# Altium schematic sheet IrIO.SchDoc: IrDA - Input/Output
size A4; Organization: Microprocessor-Design Pty Ltd; Address1: 18/110 Caroline Street; Address2: South Yarra; Address3: VIC 3141; Address4: Australia; DocumentNumber: 3; SheetNumber: 3; SheetTotal: 4
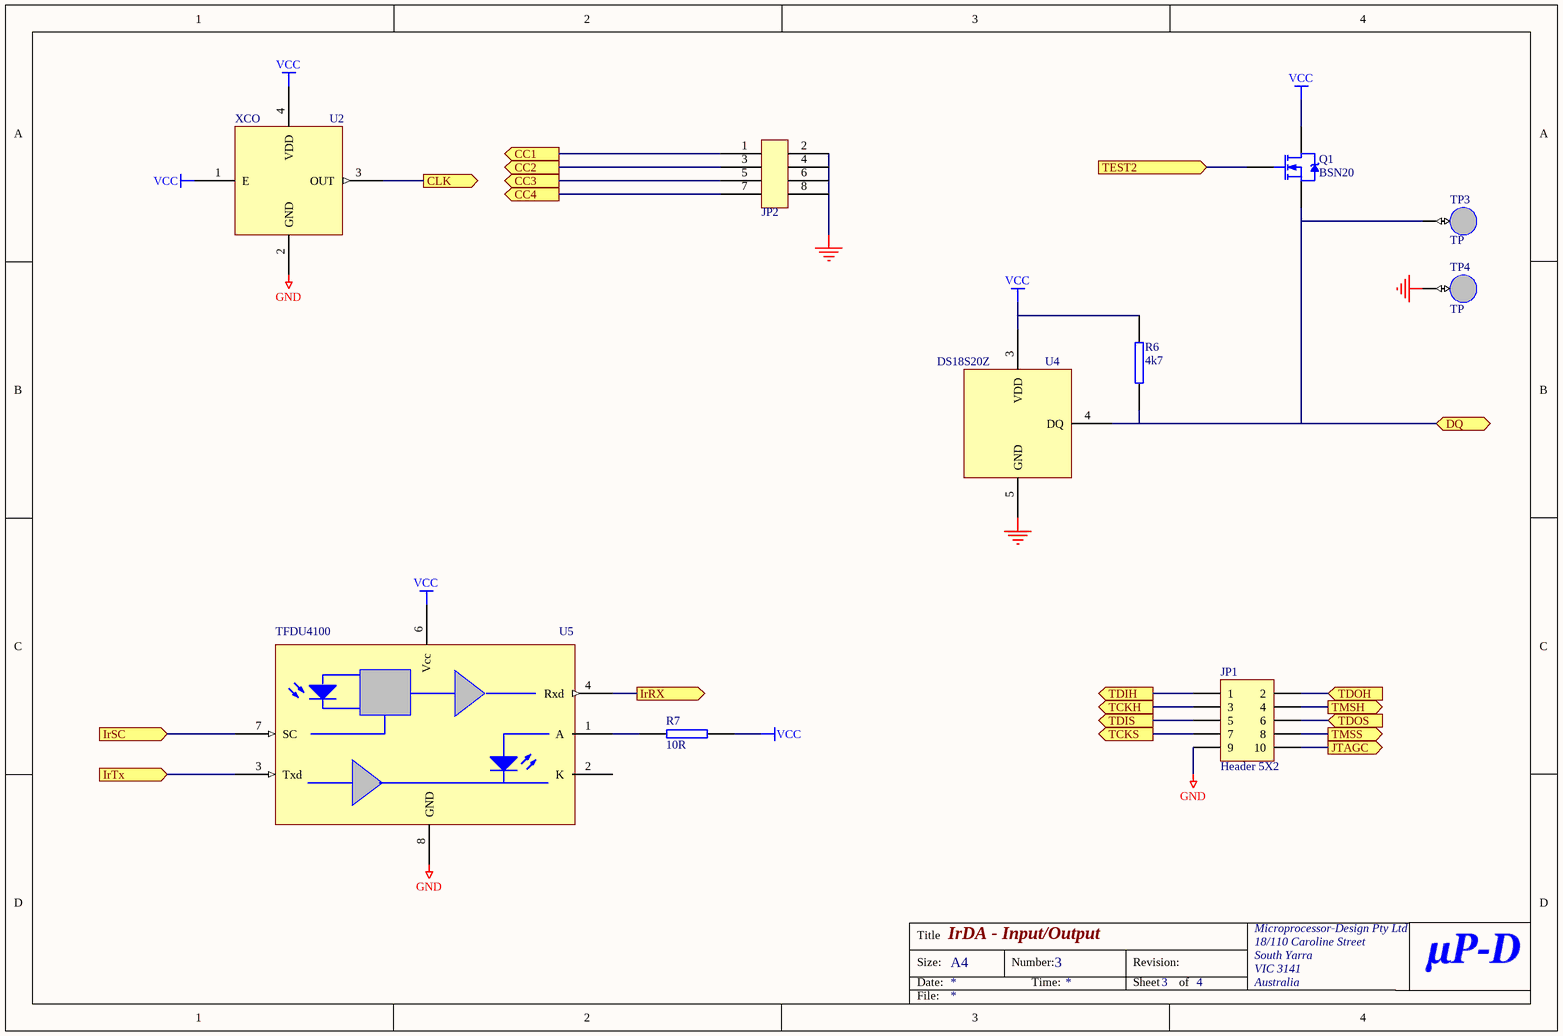
[diagram p0: IrIO.SchDoc]

## Parts
JP1  Header 5X2  [HDR2X5]
JP2  HDR4X2  [HDR4X2]  (value not drawn)
Q1  BSN20  [SOT23]
R6  4k7  [M0603]
R7  10R  [M0603]
TP3  TP  [TP]
TP4  TP  [TP]
U2  XCO  [QSMO-4200]
U4  DS18S20Z  [SO8]
U5  TFDU4100  [TDFU4100]

## Ports
CC1 (out), CC2 (out), CC3 (out), CC4 (out), CLK (out), DQ (bidir), IrRX (out), IrSC (in), IrTx (in), JTAGC (out), TCKH (out), TCKS (out), TDIH (out), TDIS (out), TDOH (in), TDOS (in), TEST2 (in), TMSH (out), TMSS (out)

## Nets
GND: JP1.9 JP2.2 JP2.4 JP2.6 JP2.8 TP4.1(test) U2.2(GND) U4.5(GND) U5.8(GND)
VCC: Q1.2(D) R6.2 R7.2 U2.1(E) U2.4(VDD) U4.3(VDD) U5.6(Vcc)
CC1: JP2.1 ; port CC1
CC2: JP2.3 ; port CC2
CC3: JP2.5 ; port CC3
CC4: JP2.7 ; port CC4
CLK: U2.3(OUT) ; port CLK
DQ: Q1.3(S) R6.1 TP3.1(test) U4.4(DQ) ; port DQ
IrRX: U5.4(Rxd) ; port IrRX
IrSC: U5.7(SC) ; port IrSC
IrTx: U5.3(Txd) ; port IrTx
JTAGC: JP1.10 ; port JTAGC
TCKH: JP1.3 ; port TCKH
TCKS: JP1.7 ; port TCKS
TDIH: JP1.1 ; port TDIH
TDIS: JP1.5 ; port TDIS
TDOH: JP1.2 ; port TDOH
TDOS: JP1.6 ; port TDOS
TEST2: Q1.1(G) ; port TEST2
TMSH: JP1.4 ; port TMSH
TMSS: JP1.8 ; port TMSS
NetR7_1: R7.1 U5.1(A)

Not connected (* = marked no-connect by the designer): U5 2(K)

## Notes on the sheet
- Title
- Size:
- Date:
- A4
- Number:
- Time:
- Revision:
- Sheet
- of
- File:

## Library data of the parts
JP1 = Header 5X2: Header, 5-Pin, Dual row; Manufacturer: Generic Components; Class I: Connector; Revision: July-2002: Re-released for DXP Platform.; Publisher: Altium Limited
JP2 = HDR4X2: HEADER 4X2 SQ PIN
Q1 = NMOSFET2
R6 R7 = RES: SMT RESISTOR
TP3 TP4 = TP: SMALL PAD
U5 = TDFU4100: IrDA TxRx; Mfr: Vishay